# EAGLE design project_02 (EAGLE 9.6.2)
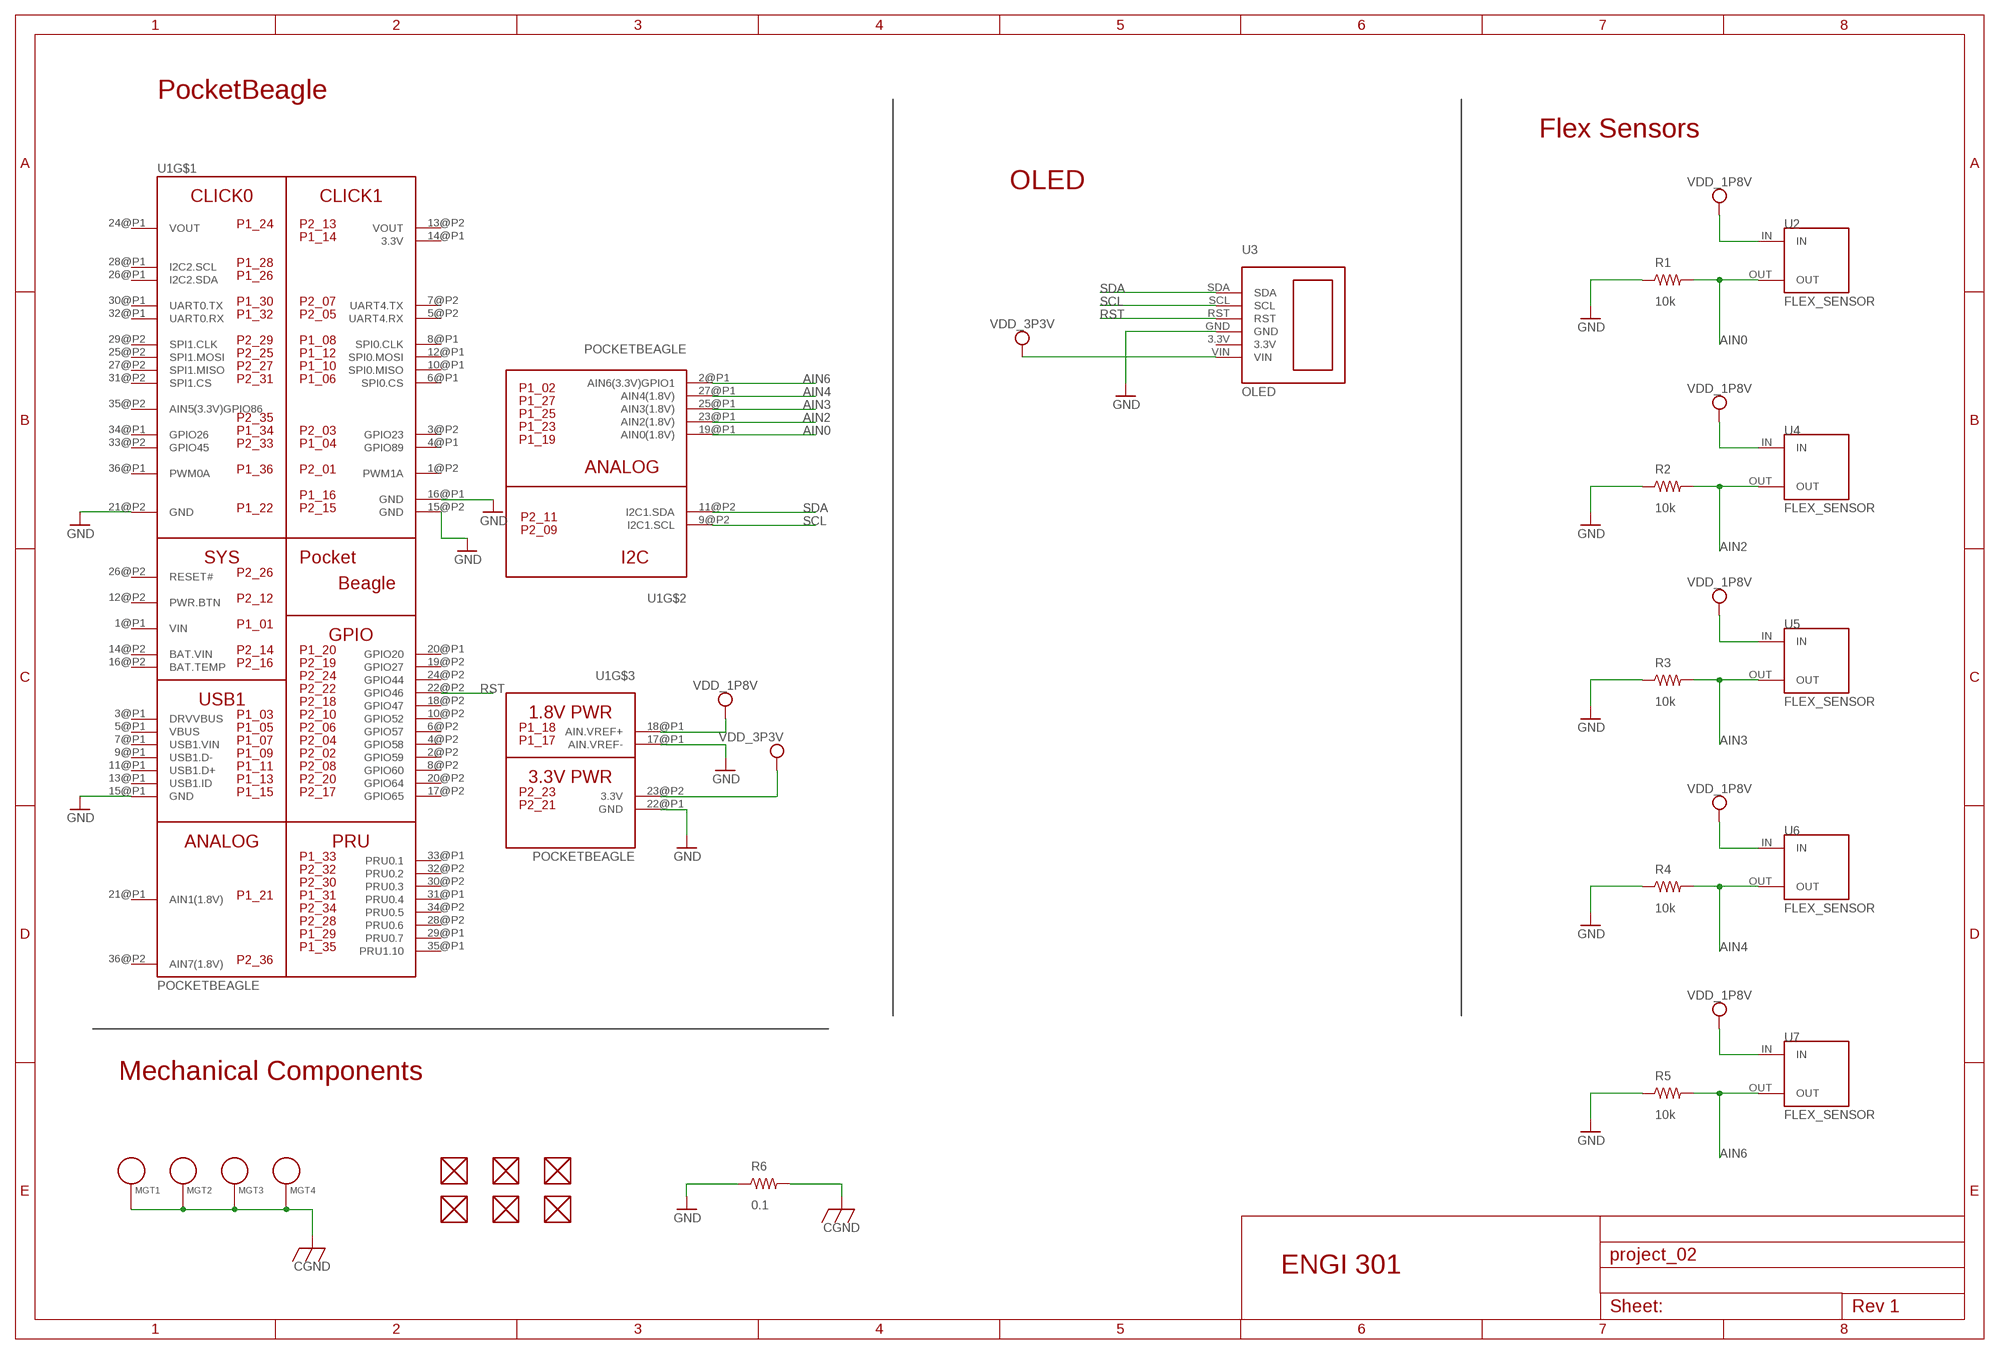
[diagram p0: schematic, sheet 1]

## Parts
FUD1  FIDUCIAL  [FIDUCIAL_40MIL]
FUD2  FIDUCIAL  [FIDUCIAL_40MIL]
FUD3  FIDUCIAL  [FIDUCIAL_40MIL]
FUD4  FIDUCIAL  [FIDUCIAL_40MIL]
FUD5  FIDUCIAL  [FIDUCIAL_40MIL]
FUD6  FIDUCIAL  [FIDUCIAL_40MIL]
MGT1  MOUNTING_HOLE  [MOUNTING_HOLE]
MGT2  MOUNTING_HOLE  [MOUNTING_HOLE]
MGT3  MOUNTING_HOLE  [MOUNTING_HOLE]
MGT4  MOUNTING_HOLE  [MOUNTING_HOLE]
R1  10k  R_R0603  [R0603]
R2  10k  R_R0603  [R0603]
R3  10k  R_R0603  [R0603]
R4  10k  R_R0603  [R0603]
R5  10k  R_R0603  [R0603]
R6  0.1  R_R0603  [R0603]
U1  POCKETBEAGLE  [POCKETBEAGLE]
U2  FLEX_SENSOR  [FLEX_SENSOR]
U3  OLED  [OLED]
U4  FLEX_SENSOR  [FLEX_SENSOR]
U5  FLEX_SENSOR  [FLEX_SENSOR]
U6  FLEX_SENSOR  [FLEX_SENSOR]
U7  FLEX_SENSOR  [FLEX_SENSOR]

## Nets
AIN0: R1.2 U1.19@P1(AIN0(1.8V)) U2.OUT
AIN2: R2.2 U1.23@P1(AIN2(1.8V)) U4.OUT
AIN3: R3.2 U1.25@P1(AIN3(1.8V)) U5.OUT
AIN4: R4.2 U1.27@P1(AIN4(1.8V)) U6.OUT
AIN6: R5.2 U1.2@P1(AIN6(3.3V)GPIO1) U7.OUT
CGND: MGT1.P$1 MGT2.P$1 MGT3.P$1 MGT4.P$1 R6.2
GND: R1.1 R2.1 R3.1 R4.1 R5.1 R6.1 U1.15@P1(GND) U1.15@P2(GND) U1.16@P1(GND) U1.17@P1(AIN.VREF-) U1.21@P2(GND) U1.22@P1(GND) U3.GND
RST: U1.22@P2(GPIO46) U3.RST
SCL: U1.9@P2(I2C1.SCL) U3.SCL
SDA: U1.11@P2(I2C1.SDA) U3.SDA
VDD_1P8V: U1.18@P1(AIN.VREF+) U2.IN U4.IN U5.IN U6.IN U7.IN
VDD_3P3V: U1.23@P2(3.3V) U3.VIN
Unconnected: FUD1.P$1 FUD2.P$1 FUD3.P$1 FUD4.P$1 FUD5.P$1 FUD6.P$1 U1.1@P2(PWM1A) U1.2@P2(GPIO59) U1.3@P1(DRVVBUS) U1.3@P2(GPIO23) U1.4@P1(GPIO89) U1.4@P2(GPIO58) U1.5@P1(VBUS) U1.5@P2(UART4.RX) U1.6@P1(SPI0.CS) U1.6@P2(GPIO57) U1.7@P1(USB1.VIN) U1.7@P2(UART4.TX) U1.8@P1(SPI0.CLK) U1.8@P2(GPIO60) U1.9@P1(USB1.D-) U1.10@P1(SPI0.MISO) U1.10@P2(GPIO52) U1.11@P1(USB1.D+) U1.12@P1(SPI0.MOSI) U1.12@P2(PWR.BTN) U1.13@P1(USB1.ID) U1.16@P2(BAT.TEMP) U1.17@P2(GPIO65) U1.18@P2(GPIO47) U1.19@P2(GPIO27) U1.20@P1(GPIO20) U1.20@P2(GPIO64) U1.21@P1(AIN1(1.8V)) U1.24@P2(GPIO44) U1.25@P2(SPI1.MOSI) U1.26@P1(I2C2.SDA) U1.26@P2(RESET#) U1.27@P2(SPI1.MISO) U1.28@P1(I2C2.SCL) U1.28@P2(PRU0.6) U1.29@P1(PRU0.7) U1.29@P2(SPI1.CLK) U1.30@P1(UART0.TX) U1.30@P2(PRU0.3) U1.31@P1(PRU0.4) U1.31@P2(SPI1.CS) U1.32@P1(UART0.RX) U1.32@P2(PRU0.2) U1.33@P1(PRU0.1) U1.33@P2(GPIO45) U1.34@P1(GPIO26) U1.34@P2(PRU0.5) U1.35@P1(PRU1.10) U1.35@P2(AIN5(3.3V)GPIO86) U1.36@P1(PWM0A) U1.36@P2(AIN7(1.8V)) U3.3.3V

## Notes on the sheet
- PocketBeagle
- Flex Sensors
- OLED
- Mechanical Components
- ENGI 301

## Power pins joined to a net without a drawn wire
3.3V: U1.14@P1(3.3V)
BAT.VIN: U1.14@P2(BAT.VIN)
VIN: U1.1@P1(VIN)
VOUT: U1.13@P2(VOUT) U1.24@P1(VOUT)

## Library data of the parts
FUD1-FUD6 = MISC:FIDUCIAL
MGT1-MGT4 = MISC:MOUNTING_HOLE: Chassis Mounting Hole w/GND connection ability
R1-R6 = MISC:R_: RESISTOR, American symbol
U1 = project2:POCKETBEAGLE
U2 U4-U7 = project2:FLEX_SENSOR: This is the flex sensor device which consists of two header pins. The flex sensor can be connected via a jumper wire to these header pins.
U3 = project2:OLED

## Board
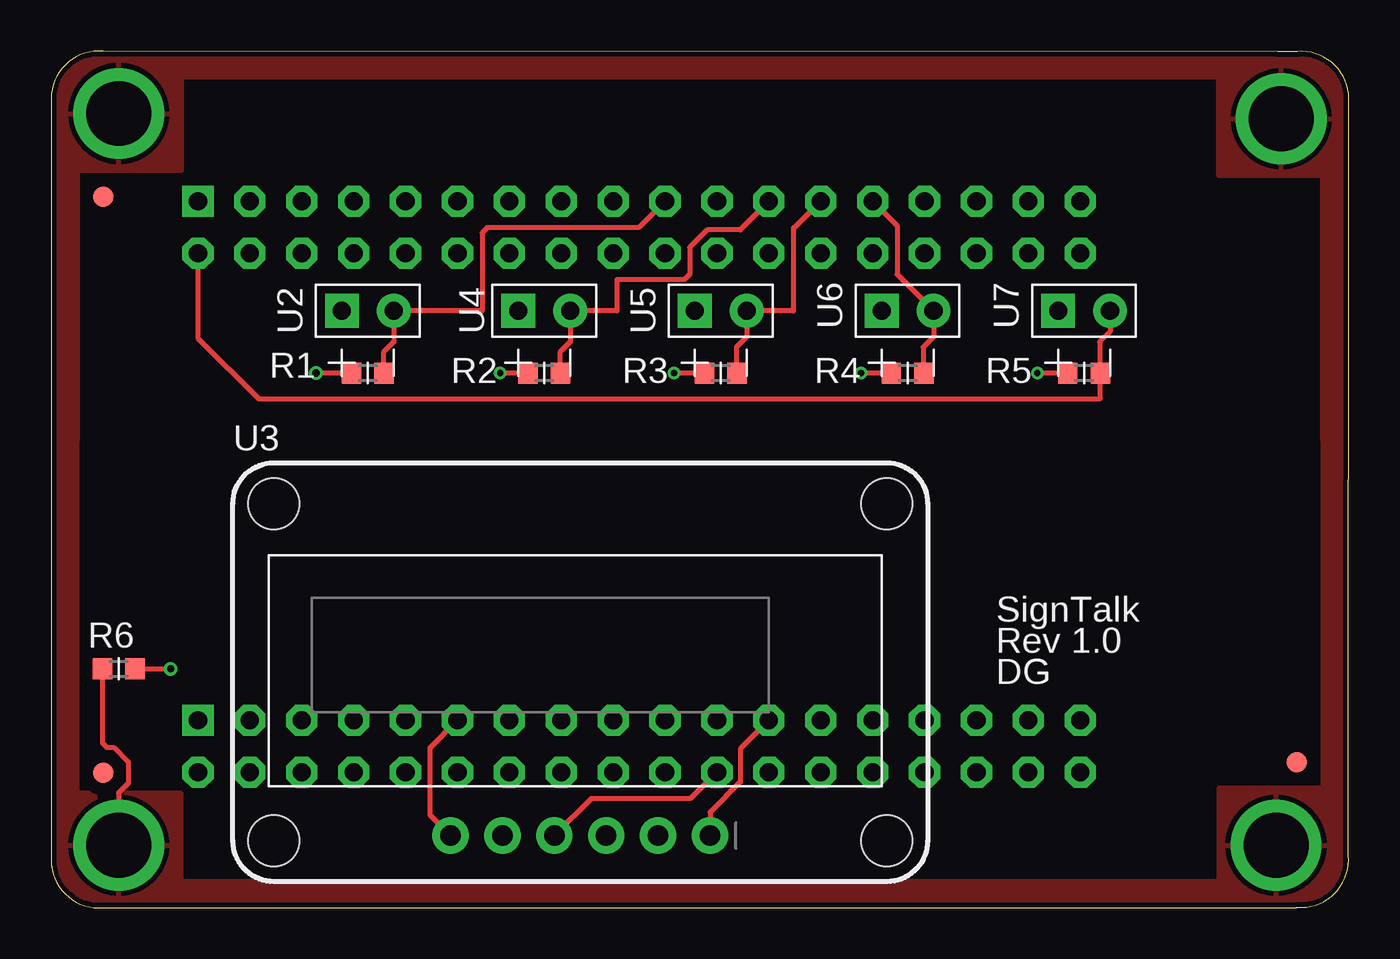
[diagram p1: board, top side]
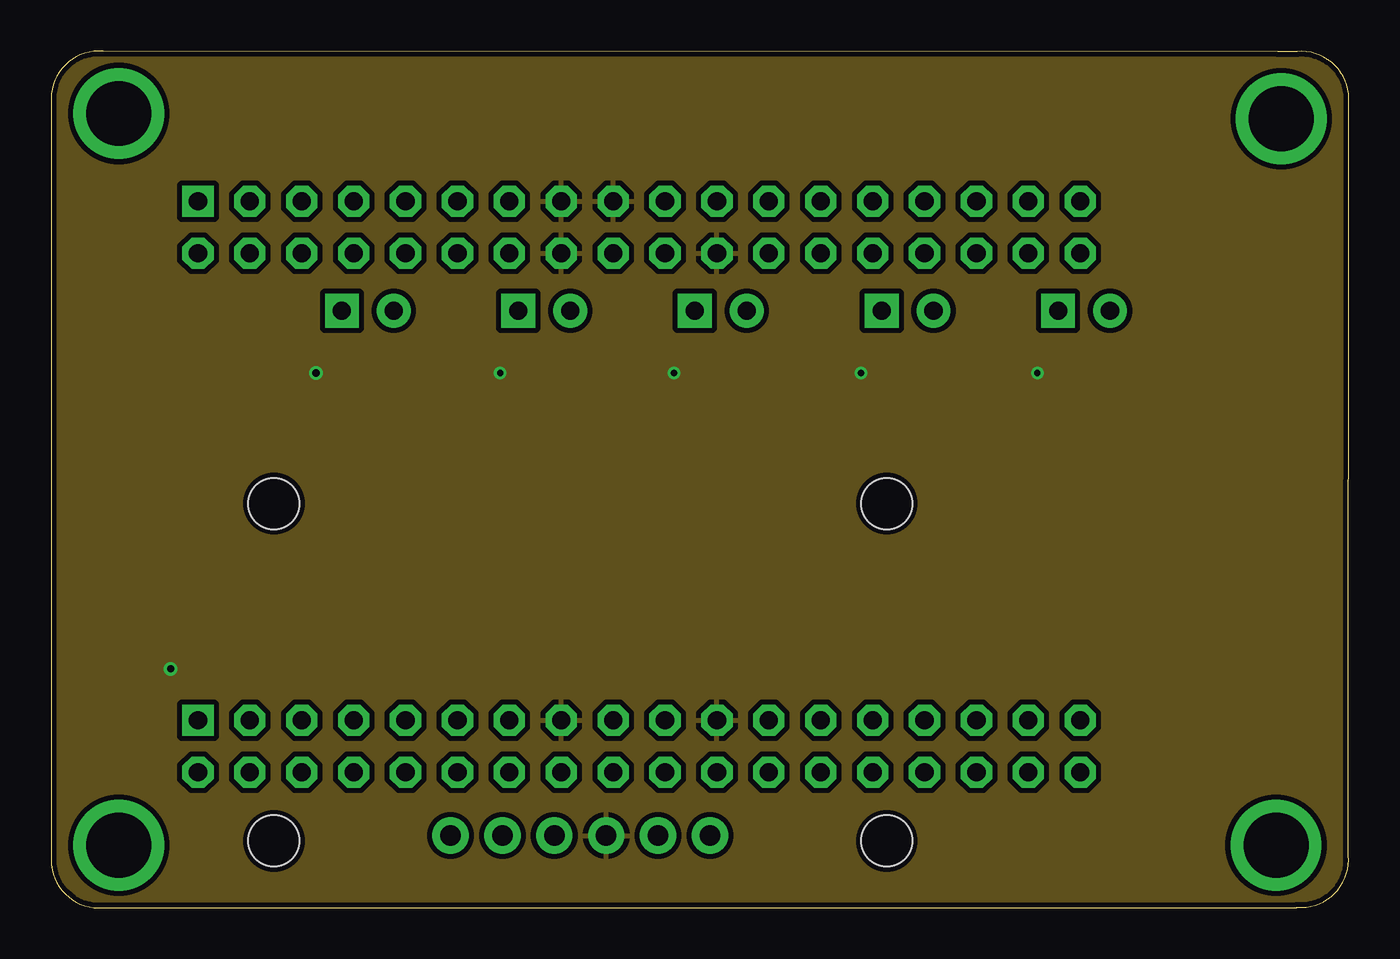
[diagram p2: board, inner layer Route2]
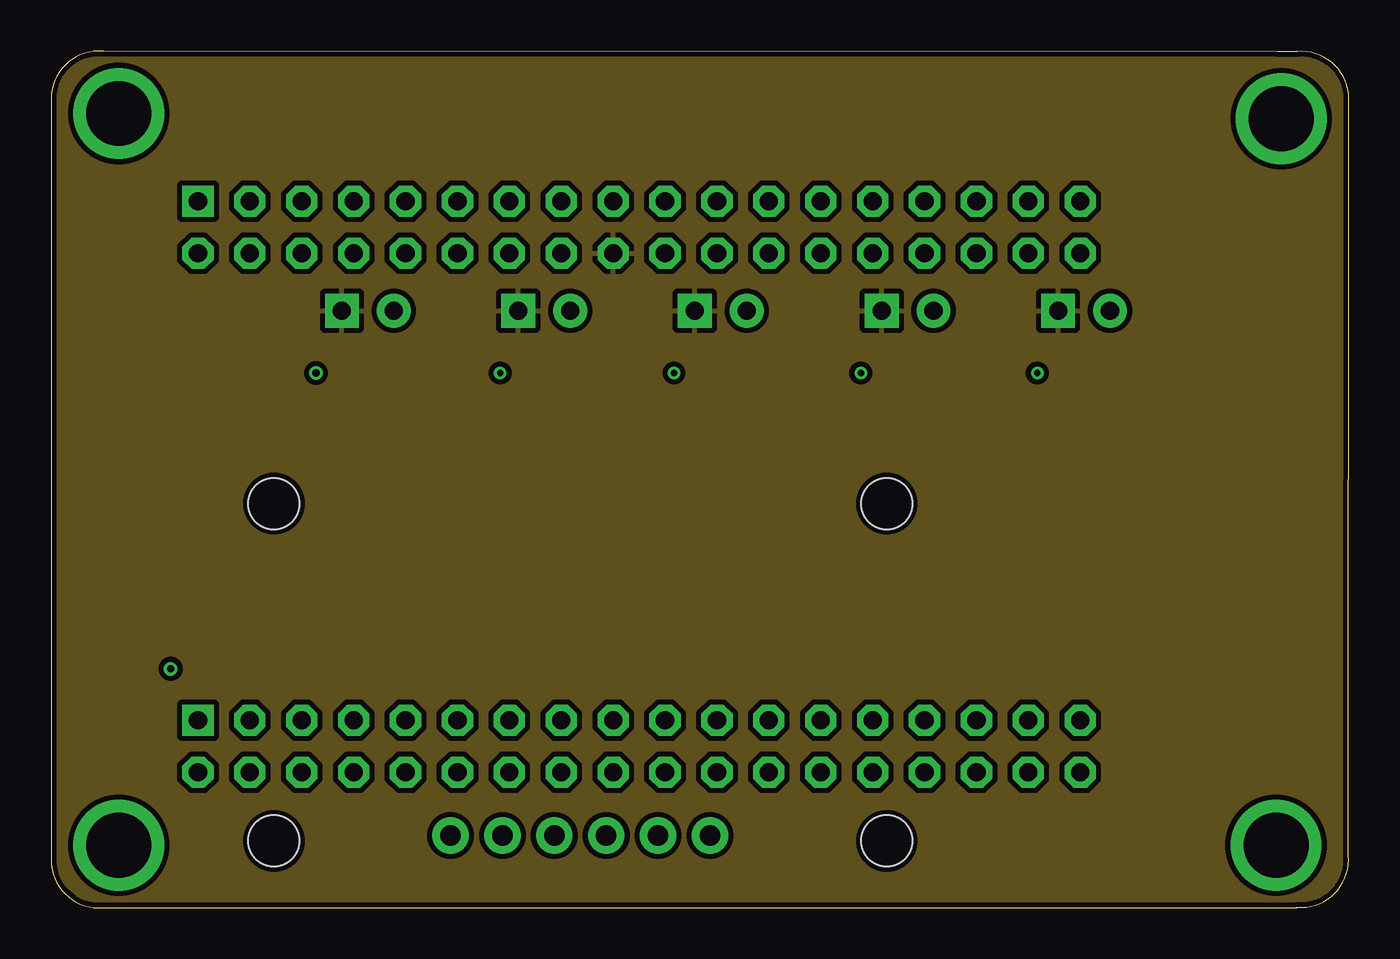
[diagram p3: board, inner layer Route15]
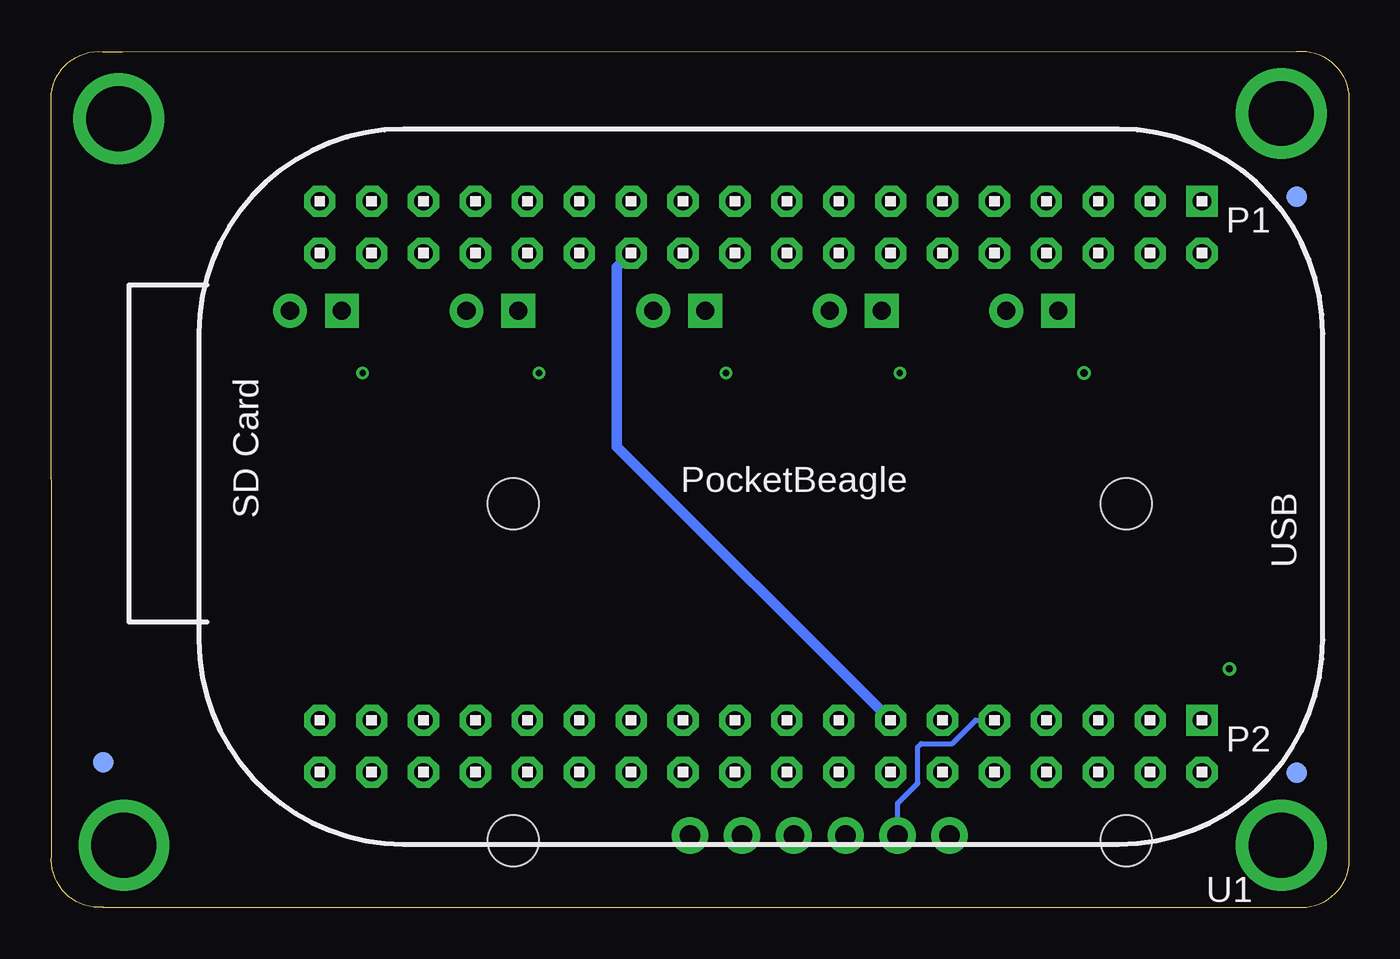
[diagram p4: board, bottom side, seen from below]

Size 63.52 x 41.93 mm. Coordinates in mm from the lower left corner, seen from the top.
Outline: 2.55,0.01 60.97,0.01 60.97,0.03 arc100 63.49,2.55 63.51,39.38 arc100 60.99,41.9 60.03,41.9 2.55,41.92 arc100 0.01,39.38 0.01,2.55 arc100 2.55,0.01
Copper layers (1*2*15*16): Top 0.035mm / dielectric 0.23mm / Route2 0.035mm / dielectric 0.93mm / Route15 0.035mm / dielectric 0.23mm / Bottom 0.035mm
Design rules "ENGI301_4lyr": minimum track width 10mil, minimum drill 12mil, track to track 10mil, track to pad 10mil, pad to pad 10mil, via to via 10mil, smd to smd 10mil, copper to edge 10mil, drill to drill 12mil, minimum pad ring 6mil, minimum via ring 6mil, stop-mask expansion 3mil, vias tented up to drill 25mil, thermal gap 10mil

### Footprints (pad centres in the part's own frame; a part is rotated, then mirrored left to right if it is on the bottom)
FIDUCIAL_40MIL = smd 1.016 x 1.016: P$1 0,0
MOUNTING_HOLE = drill 3.175 pad 4.445: P$1 0,0
R0603 = smd 0.95 x 1.031: 1 -0.8,0; 2 0.8,0
POCKETBEAGLE = drill 0.889 pad 1.524 square: 1@P1 5.91,3.53; 1@P2 5.91,28.93 | drill 0.889 pad 1.524 octagon: 2@P1 5.91,6.07; 2@P2 5.91,31.47; 3@P1 8.45,3.53; 3@P2 8.45,28.93; 4@P1 8.45,6.07; 4@P2 8.45,31.47; 5@P1 10.99,3.53; 5@P2 10.99,28.93; 6@P1 10.99,6.07; 6@P2 10.99,31.47; 7@P1 13.53,3.53; 7@P2 13.53,28.93; 8@P1 13.53,6.07; 8@P2 13.53,31.47; 9@P1 16.07,3.53; 9@P2 16.07,28.93; 10@P1 16.07,6.07; 10@P2 16.07,31.47; 11@P1 18.61,3.53; 11@P2 18.61,28.93; 12@P1 18.61,6.07; 12@P2 18.61,31.47; 13@P1 21.15,3.53; 13@P2 21.15,28.93; 14@P1 21.15,6.07; 14@P2 21.15,31.47; 15@P1 23.69,3.53; 15@P2 23.69,28.93; 16@P1 23.69,6.07; 16@P2 23.69,31.47; 17@P1 26.23,3.53; 17@P2 26.23,28.93; 18@P1 26.23,6.07; 18@P2 26.23,31.47; 19@P1 28.77,3.53; 19@P2 28.77,28.93; 20@P1 28.77,6.07; 20@P2 28.77,31.47; 21@P1 31.31,3.53; 21@P2 31.31,28.93; 22@P1 31.31,6.07; 22@P2 31.31,31.47; 23@P1 33.85,3.53; 23@P2 33.85,28.93; 24@P1 33.85,6.07; 24@P2 33.85,31.47; 25@P1 36.39,3.53; 25@P2 36.39,28.93; 26@P1 36.39,6.07; 26@P2 36.39,31.47; 27@P1 38.93,3.53; 27@P2 38.93,28.93; 28@P1 38.93,6.07; 28@P2 38.93,31.47; 29@P1 41.47,3.53; 29@P2 41.47,28.93; 30@P1 41.47,6.07; 30@P2 41.47,31.47; 31@P1 44.01,3.53; 31@P2 44.01,28.93; 32@P1 44.01,6.07; 32@P2 44.01,31.47; 33@P1 46.55,3.53; 33@P2 46.55,28.93; 34@P1 46.55,6.07; 34@P2 46.55,31.47; 35@P1 49.09,3.53; 35@P2 49.09,28.93; 36@P1 49.09,6.07; 36@P2 49.09,31.47
FLEX_SENSOR = drill 0.889 pad 1.651 square: IN 0,1.27 | drill 0.889 pad 1.651: OUT 0,-1.27
OLED = drill 1 pad 1.778: 3.3V 20.81,2.254; GND 18.27,2.254; RST 15.73,2.254; SCL 13.19,2.254; SDA 10.65,2.254; VIN 23.35,2.254 | hole 2.5: 2,2; 2,18.5; 32,18.5; 32,2

### Placement (x,y rotation side)
FUD1  2.55,34.81 0 top
FUD2  2.55,6.61 0 top
FUD3  60.97,7.12 0 top
FUD4  2.55,6.61 0 bottom
FUD5  2.55,34.81 0 bottom
FUD6  60.97,7.12 0 bottom
MGT1  3.31,38.87 0 top
MGT2  3.31,3.06 0 top
MGT3  59.95,3.06 0 top
MGT4  60.21,38.62 0 top
R1  15.5,26.17 0 top
R2  24.14,26.17 0 top
R3  32.77,26.17 0 top
R4  41.92,26.17 0 top
R5  50.55,26.17 0 top
R6  3.31,11.69 180 top
U1  1.28,38.11 180 bottom
U2  15.5,29.22 90 top
U3  8.9,1.28 0 top
U4  24.14,29.22 90 top
U5  32.77,29.22 90 top
U6  41.92,29.22 90 top
U7  50.55,29.22 90 top

### Tracks (layer width: path | path; a pad name or v marks a point on that pad's centre or on a via)
AIN0
  Top 0.254: U1.19@P1 28.75,33.28 21.34,33.28 21.09,33.03 21.09,29.22 U2.OUT 16.77,27.69 16.26,27.19 16.26,26.21 R1.2
AIN2
  Top 0.254: U1.23@P1 33.73,33.18 32.12,33.18 31.25,32.32 31.25,31 31,30.74 27.69,30.74 27.69,29.22 U4.OUT 25.41,27.69 24.9,27.19 24.9,26.21 R2.2
AIN3
  Top 0.254: U1.25@P1 36.37,33.28 36.33,33.28 36.33,29.22 U5.OUT 34.04,27.95 33.54,27.44 33.54,26.21 R3.2
AIN4
  Top 0.254: U1.27@P1 41.41,33.38 41.41,31 U6.OUT 43.19,27.95 42.68,27.44 42.68,26.21 R4.2
AIN6
  Top 0.254: U7.OUT 51.82,28.2 51.32,27.69 51.32,26.21 R5.2 51.35,24.94 51.32,24.9 10.17,24.9 7.19,27.88 U1.2@P1
CGND
  Top 0.254: R6.2 2.51,8.07 2.73,7.85 3.06,7.85 3.79,7.13 3.79,6.1 3.31,5.62 MGT2.P$1
  pour Top: -1.26,22.87 -1.26,-1.26 64.78,-1.26 64.78,22.87 62.24,22.87 62.24,5.85 57.16,5.85 57.16,1.28 6.36,1.28 6.36,5.6 1.28,5.6 1.28,22.87
  pour Top: -1.26,22.87 -1.26,43.19 64.78,43.19 64.78,22.87 62.24,22.87 62.24,35.82 57.16,35.82 57.16,40.65 6.36,40.65 6.36,36.08 1.28,36.08 1.28,22.87
GND  (via drill 0.3, 0.35)
  Top 0.254: R1.1 v12.96,26.17 | R6.1 v5.85,11.69 | R2.1 v21.98,26.17 | R3.1 v30.49,26.17 | R4.1 v39.63,26.17 | R5.1 v48.27,26.17
  pour Route2: -2.53,-2.53 -2.53,44.46 66.05,44.46 66.05,-2.53
RST
  Top 0.254: U1.22@P2 31.29,5.34 26.42,5.34 24.63,3.55 U3.RST
SCL
  Bottom 0.254: U3.SCL 22.09,5.11 21.09,6.1 21.09,7.88 20.94,8.04 19.42,8.04 18.27,9.18 U1.9@P2
SDA
  Top 0.254: U3.SDA 18.55,4.53 18.55,7.84 U1.11@P2
VDD_1P8V
  pour Route15: -5.07,-5.07 -5.07,47 68.59,47 68.59,-5.07
VDD_3P3V
  Top 0.254: U1.23@P2 33.73,7.78 33.73,6.17 32.25,4.68 U3.VIN
VOUT
  Bottom 0.508: U1.24@P1 35.82,31.34 35.82,22.57 U1.13@P2

### Text on the board
tPlace: SignTalk | Rev 1.0 | DG